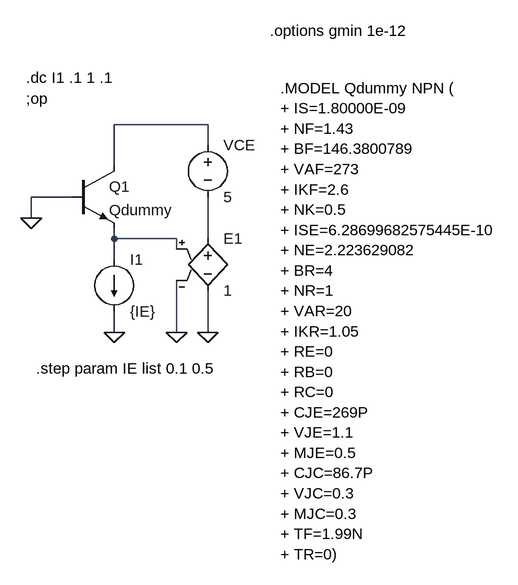
[diagram p0: schematic beta.asc]
beta.asc, the LTspice schematic file:
Version 4
SHEET 1 880 680
WIRE 208 -112 64 -112
WIRE 208 -80 208 -112
WIRE 64 -48 64 -112
WIRE 0 0 -64 0
WIRE -64 32 -64 0
WIRE 64 64 64 48
WIRE 160 64 64 64
WIRE 208 64 208 0
WIRE 160 80 160 64
WIRE 64 96 64 64
WIRE 64 208 64 176
WIRE 160 208 160 128
WIRE 208 208 208 144
FLAG -64 32 0
FLAG 64 208 0
FLAG 208 208 0
FLAG 160 208 0
SYMBOL npn 0 -48 R0
SYMATTR InstName Q1
SYMATTR Value Qdummy
SYMBOL current 64 96 R0
WINDOW 123 0 0 Left 0
WINDOW 39 0 0 Left 0
SYMATTR InstName I1
SYMATTR Value {IE}
SYMBOL e 208 48 R0
SYMATTR InstName E1
SYMATTR Value 1
SYMBOL voltage 208 -96 R0
WINDOW 123 0 0 Left 0
WINDOW 39 0 0 Left 0
SYMATTR InstName VCE
SYMATTR Value 5
TEXT -72 -184 Left 0 !.dc I1 .1 1 .1
TEXT 320 -168 Left 0 !.MODEL Qdummy NPN (\n+ IS=1.80000E-09\n+ NF=1.43\n+ BF=146.3800789\n+ VAF=273\n+ IKF=2.6\n+ NK=0.5\n+ ISE=6.28699682575445E-10\n+ NE=2.223629082\n+ BR=4\n+ NR=1\n+ VAR=20\n+ IKR=1.05\n+ RE=0\n+ RB=0\n+ RC=0\n+ CJE=269P\n+ VJE=1.1\n+ MJE=0.5\n+ CJC=86.7P\n+ VJC=0.3\n+ MJC=0.3\n+ TF=1.99N\n+ TR=0)
TEXT -72 -152 Left 0 !;op
TEXT 304 -256 Left 0 !.options gmin 1e-12
TEXT -56 264 Left 0 !.step param IE list 0.1 0.5

The netlist it stands for:
* beta.asc
Q1 N001 0 N002 0 Qdummy
I1 N002 0 {IE}
E1 N003 0 N002 0 1
VCE N001 N003 5
.model NPN NPN
.model PNP PNP
.lib standard.bjt
.dc I1 .1 1 .1
.MODEL Qdummy NPN (
+ IS=1.80000E-09
+ NF=1.43
+ BF=146.3800789
+ VAF=273
+ IKF=2.6
+ NK=0.5
+ ISE=6.28699682575445E-10
+ NE=2.223629082
+ BR=4
+ NR=1
+ VAR=20
+ IKR=1.05
+ RE=0
+ RB=0
+ RC=0
+ CJE=269P
+ VJE=1.1
+ MJE=0.5
+ CJC=86.7P
+ VJC=0.3
+ MJC=0.3
+ TF=1.99N
+ TR=0)
;op
.options gmin 1e-12
.step param IE list 0.1 0.5
.backanno
.end